# EAGLE design controller (EAGLE 9.5.1)
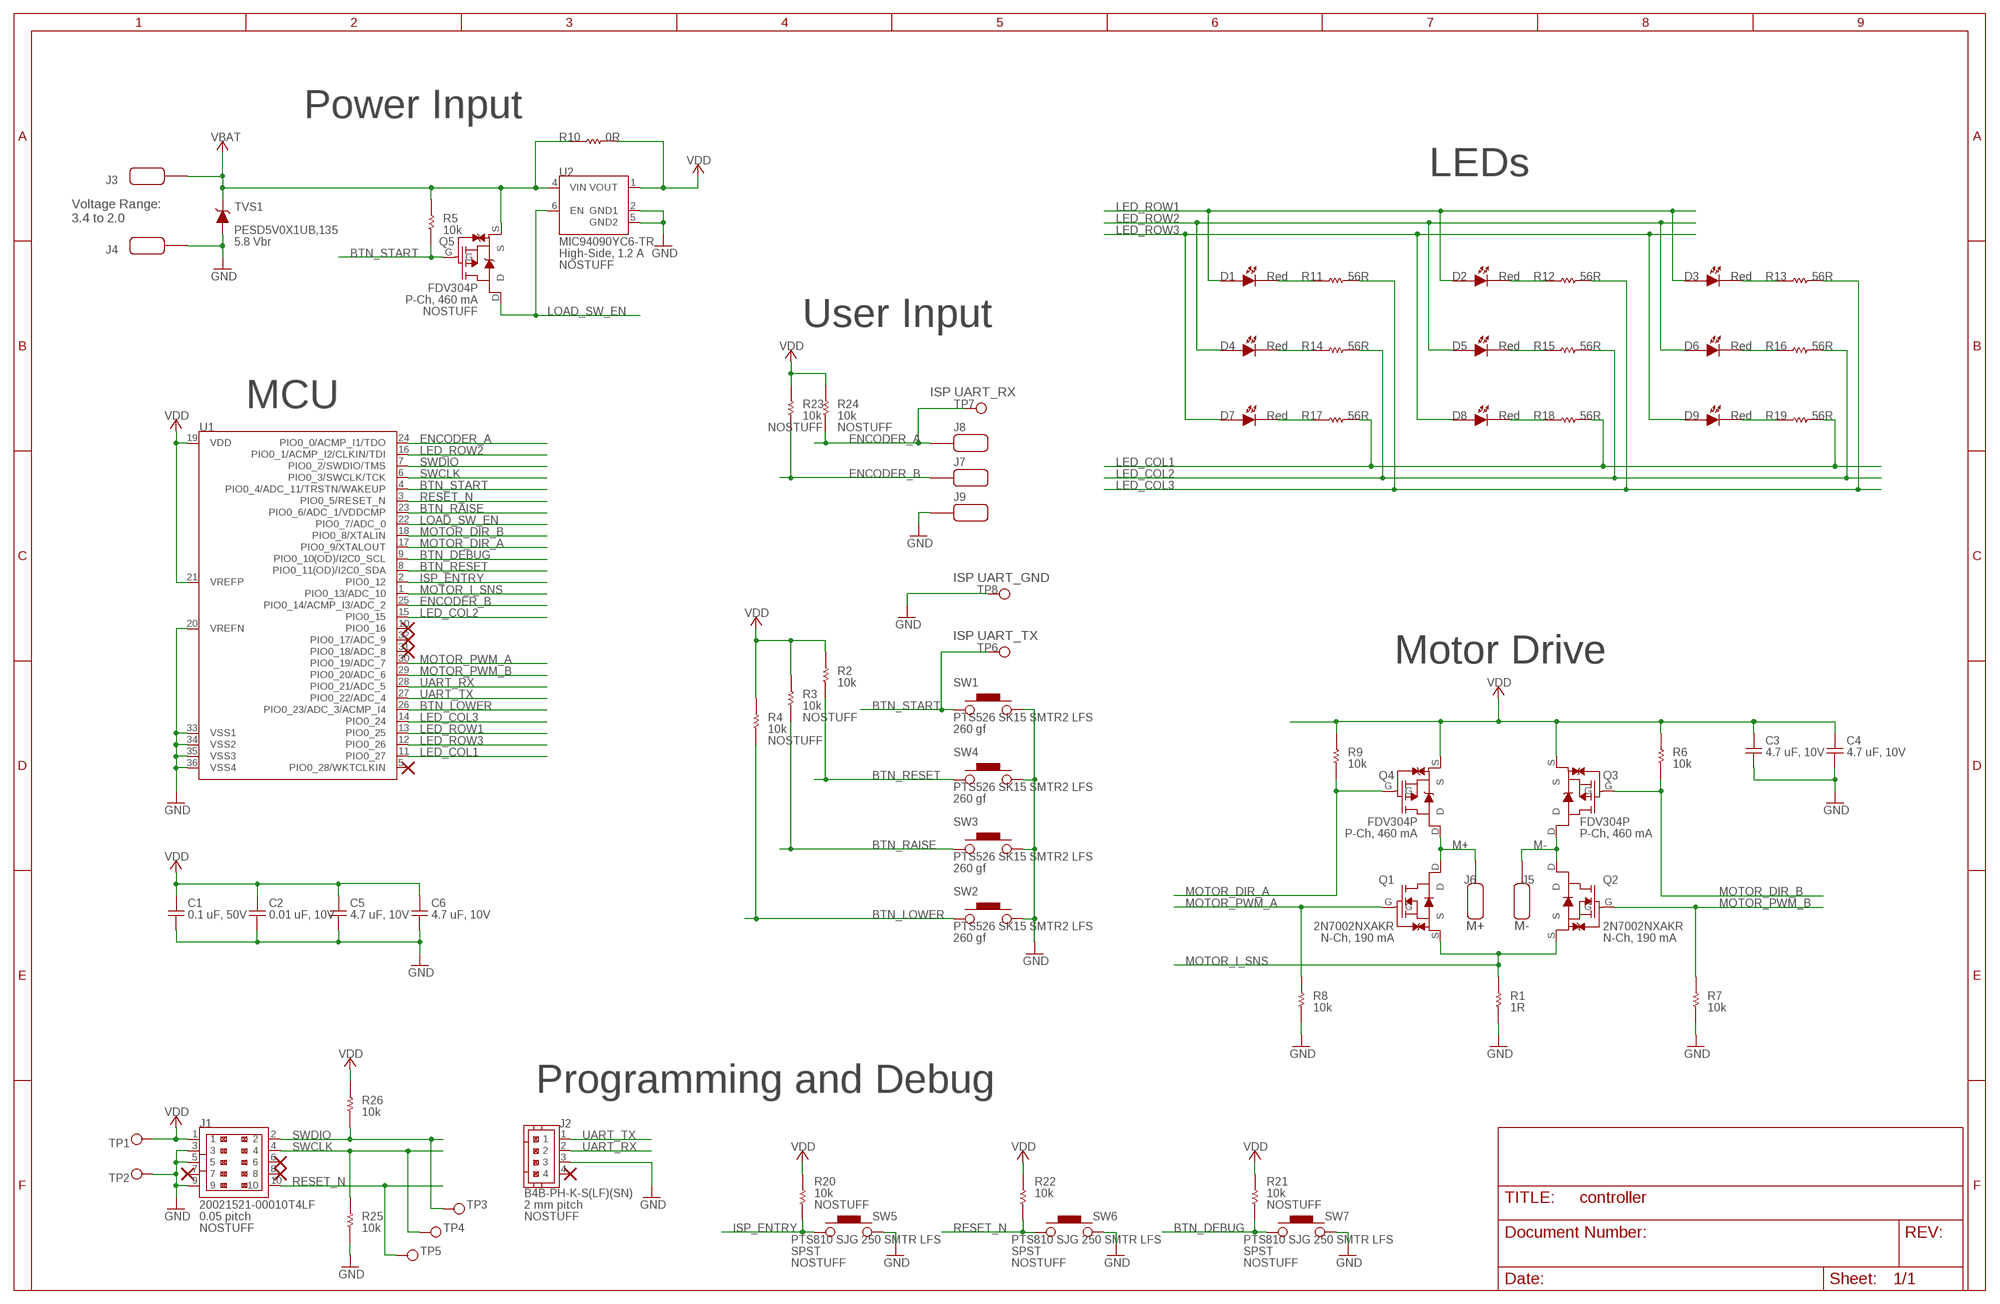
[diagram p0: schematic, sheet 1]

## Parts
C1  CAP_C1608X7R1H104K080AA  [CAP_0603]
C2  CAP_CL10B103KB8NNNC  [CAP_0603]
C3  CAP_CGB3B1X5R1A475M055AC  [CAP_0603]
C4  CAP_CGB3B1X5R1A475M055AC  [CAP_0603]
C5  CAP_CGB3B1X5R1A475M055AC  [CAP_0603]
C6  CAP_CGB3B1X5R1A475M055AC  [CAP_0603]
D1  LED_150060RS75000  [LED_0603]
D2  LED_150060RS75000  [LED_0603]
D3  LED_150060RS75000  [LED_0603]
D4  LED_150060RS75000  [LED_0603]
D5  LED_150060RS75000  [LED_0603]
D6  LED_150060RS75000  [LED_0603]
D7  LED_150060RS75000  [LED_0603]
D8  LED_150060RS75000  [LED_0603]
D9  LED_150060RS75000  [LED_0603]
J1  20021521-00010T4LF  [HEADER_2X5_50MIL_SHROUDED_KEYED]
J2  B4B-PH-K-S  [JST-PH_2MM_TH]
J3  PAD_1P4X3P25MM  [PAD_1P4MM_X_3P25MM]
J4  PAD_1P4X3P25MM  [PAD_1P4MM_X_3P25MM]
J5  PAD_1P4X3P25MM  [PAD_1P4MM_X_3P25MM]
J6  PAD_1P4X3P25MM  [PAD_1P4MM_X_3P25MM]
J7  PAD_1P4X3P25MM  [PAD_1P4MM_X_3P25MM]
J8  PAD_1P4X3P25MM  [PAD_1P4MM_X_3P25MM]
J9  PAD_1P4X3P25MM  [PAD_1P4MM_X_3P25MM]
Q1  2N7002NXAKR  [SOT-23_FET_GENERIC]
Q2  2N7002NXAKR  [SOT-23_FET_GENERIC]
Q3  FDV304P  [SOT-23_FET_GENERIC]
Q4  FDV304P  [SOT-23_FET_GENERIC]
Q5  FDV304P  [SOT-23_FET_GENERIC]
R1  RES_1R_RMCF0603FT1R00  [RES_0603]
R2  RES_10K_RC0603FR-0710KL  [RES_0603]
R3  RES_10K_RC0603FR-0710KL  [RES_0603]
R4  RES_10K_RC0603FR-0710KL  [RES_0603]
R5  RES_10K_RC0603FR-0710KL  [RES_0603]
R6  RES_10K_RC0603FR-0710KL  [RES_0603]
R7  RES_10K_RC0603FR-0710KL  [RES_0603]
R8  RES_10K_RC0603FR-0710KL  [RES_0603]
R9  RES_10K_RC0603FR-0710KL  [RES_0603]
R10  RES_0R_RC0603JR-070RL  [RES_0603]
R11  RES_56R_RC0603FR-0756RL  [RES_0603]
R12  RES_56R_RC0603FR-0756RL  [RES_0603]
R13  RES_56R_RC0603FR-0756RL  [RES_0603]
R14  RES_56R_RC0603FR-0756RL  [RES_0603]
R15  RES_56R_RC0603FR-0756RL  [RES_0603]
R16  RES_56R_RC0603FR-0756RL  [RES_0603]
R17  RES_56R_RC0603FR-0756RL  [RES_0603]
R18  RES_56R_RC0603FR-0756RL  [RES_0603]
R19  RES_56R_RC0603FR-0756RL  [RES_0603]
R20  RES_10K_RC0603FR-0710KL  [RES_0603]
R21  RES_10K_RC0603FR-0710KL  [RES_0603]
R22  RES_10K_RC0603FR-0710KL  [RES_0603]
R23  RES_10K_RC0603FR-0710KL  [RES_0603]
R24  RES_10K_RC0603FR-0710KL  [RES_0603]
R25  RES_10K_RC0603FR-0710KL  [RES_0603]
R26  RES_10K_RC0603FR-0710KL  [RES_0603]
SW1  PTS526_SK15_SMTR2_LFS  [PTS526-G_LEAD]
SW2  PTS526_SK15_SMTR2_LFS  [PTS526-G_LEAD]
SW3  PTS526_SK15_SMTR2_LFS  [PTS526-G_LEAD]
SW4  PTS526_SK15_SMTR2_LFS  [PTS526-G_LEAD]
SW5  PTS810_SJG_250_SMTR_LFS  [PTS810]
SW6  PTS810_SJG_250_SMTR_LFS  [PTS810]
SW7  PTS810_SJG_250_SMTR_LFS  [PTS810]
TP1  TP_1P6_MM_ROUND  [TP_1P6_MM_ROUND]
TP2  TP_1P6_MM_ROUND  [TP_1P6_MM_ROUND]
TP3  TP_1P6_MM_ROUND  [TP_1P6_MM_ROUND]
TP4  TP_1P6_MM_ROUND  [TP_1P6_MM_ROUND]
TP5  TP_1P6_MM_ROUND  [TP_1P6_MM_ROUND]
TP6  TP_1P6_MM_ROUND  [TP_1P6_MM_ROUND]
TP7  TP_1P6_MM_ROUND  [TP_1P6_MM_ROUND]
TP8  TP_1P6_MM_ROUND  [TP_1P6_MM_ROUND]
TVS1  PESD5V0X1UB,135  [SOD523]
U1  LPC822M101JHI33ELPC82X_VQFN33_HAND_SOLDER  [LPC82X_VQFN33_HAND_SOLDER]
U2  MIC94090YC6  [SC-70-6_GENERIC]

## Nets
BTN_DEBUG: R21.P$1 SW7.P1 U1.9(PIO0_10(OD)/I2C0_SCL)
BTN_LOWER: R4.P$1 SW2.1 U1.26(PIO0_23/ADC_3/ACMP_I4)
BTN_RAISE: R3.P$1 SW3.1 U1.23(PIO0_6/ADC_1/VDDCMP)
BTN_RESET: R2.P$1 SW4.1 U1.8(PIO0_11(OD)/I2C0_SDA)
BTN_START: Q5.G R5.P$1 SW1.1 TP6.P$1(P1) U1.4(PIO0_4/ADC_11/TRSTN/WAKEUP)
ENCODER_A: J8.1(PAD) R24.P$1 TP7.P$1(P1) U1.24(PIO0_0/ACMP_I1/TDO)
ENCODER_B: J7.1(PAD) R23.P$1 U1.25(PIO0_14/ACMP_I3/ADC_2)
GND: C1.P$2 C2.P$2 C3.P$2 C4.P$2 C5.P$2 C6.P$2 J1.3 J1.5 J1.9 J2.3 J4.1(PAD) J9.1(PAD) R1.P$1 R7.P$1 R8.P$1 R25.P$1 SW1.3(P2) SW2.3(P2) SW3.3(P2) SW4.3(P2) SW5.P3(P2) SW6.P3(P2) SW7.P3(P2) TP2.P$1(P1) TP8.P$1(P1) TVS1.A U1.20(VREFN) U1.33(VSS1) U1.34(VSS2) U1.35(VSS3) U1.36(VSS4) U2.2(GND1) U2.5(GND2)
ISP_ENTRY: R20.P$1 SW5.P1 U1.2(PIO0_12)
LED_COL1: R17.P$2 R18.P$2 R19.P$2 U1.11(PIO0_27)
LED_COL2: R14.P$2 R15.P$2 R16.P$2 U1.15(PIO0_15)
LED_COL3: R11.P$2 R12.P$2 R13.P$2 U1.14(PIO0_24)
LED_ROW1: D1.A D2.A D3.A U1.13(PIO0_25)
LED_ROW2: D4.A D5.A D6.A U1.16(PIO0_1/ACMP_I2/CLKIN/TDI)
LED_ROW3: D7.A D8.A D9.A U1.12(PIO0_26)
LOAD_SW_EN: Q5.D U1.22(PIO0_7/ADC_0) U2.6(EN)
M+: J6.1(PAD) Q1.D Q4.D
M-: J5.1(PAD) Q2.D Q3.D
MOTOR_DIR_A: Q4.G R9.P$1 U1.17(PIO0_9/XTALOUT)
MOTOR_DIR_B: Q3.G R6.P$1 U1.18(PIO0_8/XTALIN)
MOTOR_I_SNS: Q1.S Q2.S R1.P$2 U1.1(PIO0_13/ADC_10)
MOTOR_PWM_A: Q1.G R8.P$2 U1.30(PIO0_19/ADC_7)
MOTOR_PWM_B: Q2.G R7.P$2 U1.29(PIO0_20/ADC_6)
N$2: D1.K R11.P$1
N$4: D4.K R14.P$1
N$8: D7.K R17.P$1
N$9: D2.K R12.P$1
N$10: D5.K R15.P$1
N$11: D8.K R18.P$1
N$12: D3.K R13.P$1
N$13: D6.K R16.P$1
N$14: D9.K R19.P$1
RESET_N: J1.10 R22.P$1 SW6.P1 TP5.P$1(P1) U1.3(PIO0_5/RESET_N)
SWCLK: J1.4 R25.P$2 TP4.P$1(P1) U1.6(PIO0_3/SWCLK/TCK)
SWDIO: J1.2 R26.P$1 TP3.P$1(P1) U1.7(PIO0_2/SWDIO/TMS)
UART_RX: J2.2 U1.28(PIO0_21/ADC_5)
UART_TX: J2.1 U1.27(PIO0_22/ADC_4)
VBAT: J3.1(PAD) Q5.S R5.P$2 R10.P$1 TVS1.K U2.4(VIN)
VDD: C1.P$1 C2.P$1 C3.P$1 C4.P$1 C5.P$1 C6.P$1 J1.1 Q3.S Q4.S R2.P$2 R3.P$2 R4.P$2 R6.P$2 R9.P$2 R10.P$2 R20.P$2 R21.P$2 R22.P$2 R23.P$2 R24.P$2 R26.P$2 TP1.P$1(P1) U1.19(VDD) U1.21(VREFP) U2.1(VOUT)
Unconnected: J1.6 J1.7 J1.8 J2.4 U1.5(PIO0_28/WKTCLKIN) U1.10(PIO0_16) U1.31(PIO0_18/ADC_8) U1.32(PIO0_17/ADC_9)

## Notes on the sheet
- Power Input
- LEDs
- Voltage Range:
  3.4 to 2.0
- User Input
- ISP UART_RX
- MCU
- ISP UART_GND
- ISP UART_TX
- Motor Drive
- M+ | M-
- Programming and Debug

## Library data of the parts
C1 = teatotler:CAP_C1608X7R1H104K080AA; COST_X1: 0.1; COST_X100: 0.022; COST_X500: 0.0154; DESCRIPTION: Capacitor, 0.1 uF, 50V, 0603, X7R; DISPLAY: 0.1 uF, 50V; DISTRIBUTOR: Digikey; DIST_PART_NO: 445-1314-1-ND; MFG: TDK; MFG_PART_NO: C1608X7R1H104K080AA; PACKAGE: 0603
C2 = teatotler:CAP_CL10B103KB8NNNC; COST_X1: 0.1; COST_X100: 0.0078; COST_X500: 0.00542; DESCRIPTION: Capacitor, 10 nF, 50V, 0603, X7R; DISPLAY: 0.01 uF, 10V; DISTRIBUTOR: Digikey; DIST_PART_NO: 1276-1009-1-ND; MFG: Samsung; MFG_PART_NO: CL10B103KB8NNNC; PACKAGE: 0603
C3-C6 = teatotler:CAP_CGB3B1X5R1A475M055AC; COST_X1: 0.24; COST_X10: 0.1; COST_X100: 0.1; COST_X500: 0.06626; DESCRIPTION: Capacitor, 4.7 uF, 10V, 0603, X5R; DISPLAY: 4.7 uF, 10V; DISTRIBUTOR: Digikey; DIST_PART_NO: 445-7483-1-ND; MFG: TDK; MFG_PART_NO: CGB3B1X5R1A475M055AC; PACKAGE: 0603
D1-D9 = teatotler:LED_150060RS75000; COST_X1: 0.14; COST_X10: 0.14; COST_X100: 0.114; COST_X500: 0.099; DESCRIPTION: LED, Red, Clear, V_f=2V, 250 mcd @ 20 mA, 0603; DISPLAY: Red; DISTRIBUTOR: Digikey; DIST_PART_NO: 732-4978-1-ND; MFG: Wurth Elektronik; MFG_PART_NO: 150060RS75000; PACKAGE: 0603
J1 = teatotler:20021521-00010T4LF; COST_X1: 1.43; COST_X10: 1.253; COST_X100: 1.0813; COST_X500: 0.8847; DESCRIPTION: Header, 2x10, 0.050 mil pitch, SMT, shrouded, keyed; DISPLAY: 0.05 pitch; DISTRIBUTOR: Digikey; DIST_PART_NO: 609-6534-ND; MFG: Amphenol; MFG_PART_NO: 20021521-00010T4LF; NOSTUFF: NOSTUFF; PACKAGE: SMT
J2 = teatotler:B4B-PH-K-S; COST_X1: 0.24; COST_X10: 0.227; COST_X100: 0.1573; COST_X500: 0.13312; DESCRIPTION: Header, 1x4, 0.2 mm pitch, TH, shrouded, keyed; DISPLAY: 2 mm pitch; DISTRIBUTOR: Digikey; DIST_PART_NO: 455-1706-ND; MFG: JST; MFG_PART_NO: B4B-PH-K-S(LF)(SN); NOSTUFF: NOSTUFF; PACKAGE: TH
J3-J9 = teatotler:PAD_1P4X3P25MM; DESCRIPTION: SMT solder pad; DISPLAY: SMT Pad
Q1 Q2 = teatotler:2N7002NXAKR: MOSFET N-Channel 60V, V_gs=20V 190mA (Ta) @ V_gs=10V 4.5Ohm @ 100mA, 10V; COST_X1: 0.1; COST_X10: 0.078; COST_X100: 0.0427; COST_X500: 0.02626; DESCRIPTION: N-channel MOSFET, 60 V, 190 mA @ V_gs=10 V, SOT-23; DISPLAY: N-Ch, 190 mA; DISTRIBUTOR: Digikey; DIST_PART_NO: 1727-8643-1-ND; MFG: Nexperia; MFG_PART_NO: 2N7002NXAKR; PACKAGE: SOT-23
Q3 Q4 = teatotler:FDV304P: MOSFET P-Channel MOSFET P-CH 25V 460MA SOT-23; COST_X1: 0.30; COST_X10: 0.247; COST_X100: 0.1309; COST_X500: 0.08614; DESCRIPTION: P-channel MOSFET, 25 V, 460 mA @ V_gs=8 V, SOT-23; DISPLAY: P-Ch, 460 mA; DISTRIBUTOR: Digikey; DIST_PART_NO: FDV304PCT-ND; MFG: On Semi; MFG_PART_NO: FDV304P; PACKAGE: SOT-23
Q5 = teatotler:FDV304P: MOSFET P-Channel MOSFET P-CH 25V 460MA SOT-23; COST_X1: 0.30; COST_X10: 0.247; COST_X100: 0.1309; COST_X500: 0.08614; DESCRIPTION: P-channel MOSFET, 25 V, 460 mA @ V_gs=8 V, SOT-23; DISPLAY: P-Ch, 460 mA; DISTRIBUTOR: Digikey; DIST_PART_NO: FDV304PCT-ND; MFG: On Semi; MFG_PART_NO: FDV304P; NOSTUFF: NOSTUFF; PACKAGE: SOT-23
R1 = teatotler:RES_1R_RMCF0603FT1R00; COST_X1: 0.1; COST_X10: 0.025; COST_X100: 0.01020; COST_X500: 0.01020; DESCRIPTION: Resistor, 1R, 0603; DISPLAY: 1R; DISTRIBUTOR: Digikey; DIST_PART_NO: RMCF0603FT1R00CT-ND; MFG: Stackpole; MFG_PART_NO: RMCF0603FT1R00; PACKAGE: 0603
R2 R5-R9 R22 R25 R26 = teatotler:RES_10K_RC0603FR-0710KL; COST_X1: .01; COST_X100: .0063; COST_X500: .00382; DESCRIPTION: Resistor, 10k, 1%, 0603, 100 ppm/C; DISPLAY: 10k; DISTRIBUTOR: Digikey; DIST_PART_NO: 311-10.0KHRCT-ND; MFG: Yageo; MFG_PART_NO: RC0603FR-0710KL; PACKAGE: 0603
R3 R4 R20 R21 R23 R24 = teatotler:RES_10K_RC0603FR-0710KL; COST_X1: .01; COST_X100: .0063; COST_X500: .00382; DESCRIPTION: Resistor, 10k, 1%, 0603, 100 ppm/C; DISPLAY: 10k; DISTRIBUTOR: Digikey; DIST_PART_NO: 311-10.0KHRCT-ND; MFG: Yageo; MFG_PART_NO: RC0603FR-0710KL; NOSTUFF: NOSTUFF; PACKAGE: 0603
R10 = teatotler:RES_0R_RC0603JR-070RL; COST_X1: 0.1; COST_X100: 0.0045; COST_X500: 0.00278; DESCRIPTION: Resistor, 0R, 0603; DISPLAY: 0R; DISTRIBUTOR: Digikey; DIST_PART_NO: 311-0.0GRCT-ND; MFG: Yageo; MFG_PART_NO: RC0603JR-070RL; PACKAGE: 0603
R11-R19 = teatotler:RES_56R_RC0603FR-0756RL; COST_X1: 0.1; COST_X10: 0.023; COST_X100: 0.0094; COST_X500: 0.0094; DESCRIPTION: Resistor, 56R, 1%, 0603, 100 ppm/C; DISPLAY: 56R; DISTRIBUTOR: Digikey; DIST_PART_NO: 311-56.0HRCT-ND; MFG: Yageo; MFG_PART_NO: RC0603FR-0756RL; PACKAGE: 0603
SW1-SW4 = teatotler:PTS526_SK15_SMTR2_LFS; COST_X1: 0.1; COST_X10: 0.085; COST_X100: 0.075; COST_X500: 0.06768; DESCRIPTION: Tactile switch, 260 gf, 5.2 mm x 5.2 mm, 1.5 mm height; DISPLAY: 260 gf; DISTRIBUTOR: Digikey; DIST_PART_NO: CKN12221-1-ND; MFG: C and K; MFG_PART_NO: PTS526 SK15 SMTR2 LFS; PACKAGE: SMT
SW5-SW7 = teatotler:PTS810_SJG_250_SMTR_LFS; COST_X1: 0.3; COST_X100: 0.2585; COST_X500: 0.2068; DESCRIPTION: Tact switch, SMT, 4.2mm x 3.2mm, 400 gf; DISPLAY: SPST; DISTRIBUTOR: Digikey; DIST_PART_NO: CKN10504CT-ND; MFG: C and K; MFG_PART_NO: PTS810 SJG 250 SMTR LFS; NOSTUFF: NOSTUFF; PACKAGE: SMT
TP1-TP8 = teatotler:TP_1P6_MM_ROUND: Test Point 1.6 mm Round; DESCRIPTION: Test point, SMT, circular, 1.6 mm diameter; DISPLAY: Test Point
TVS1 = teatotler:PESD5V0X1UB,135; COST_X1: 0.45; COST_X100: 0.288; COST_X500: 0.22626; DESCRIPTION: TVS diode, 5 Vs, 5.8 Vbr, 8 Vcl, 0.95 pF, 8 kV, 200 mW; DISPLAY: 5.8 Vbr; DISTRIBUTOR: Digikey; DIST_PART_NO: 1727-5906-1-ND; MFG: NXP; MFG_PART_NO: PESD5V0X1UB,135; PACKAGE: SOD523
U1 = teatotler:LPC822M101JHI33E; COST_X1: 1.54; COST_X10: 1.383; COST_X100: 1.1119; COST_X500: 0.9135; DESCRIPTION: Microcontroller, Cortex M0+, 4 kB SRAM, 16 kB Flash, 30 MHz; DISPLAY: Cortex M0+; DISTRIBUTOR: Digikey; DIST_PART_NO: 568-11571-ND; MFG: NXP; MFG_PART_NO: LPC822M101JHI33E; PACKAGE: HVQFN33 5x5
U2 = teatotler:MIC94090YC6; COST_X1: 0.31; COST_X10: 0.31; COST_X100: 0.26; COST_X500: 0.24; DESCRIPTION: Load switch, high-side, 1.2 A, SC-70-6; DISPLAY: High-Side, 1.2 A; DISTRIBUTOR: Digikey; DIST_PART_NO: 576-3484-1-ND; MFG: Micrel; MFG_PART_NO: MIC94090YC6-TR; NOSTUFF: NOSTUFF; PACKAGE: SC-70-6

## Board
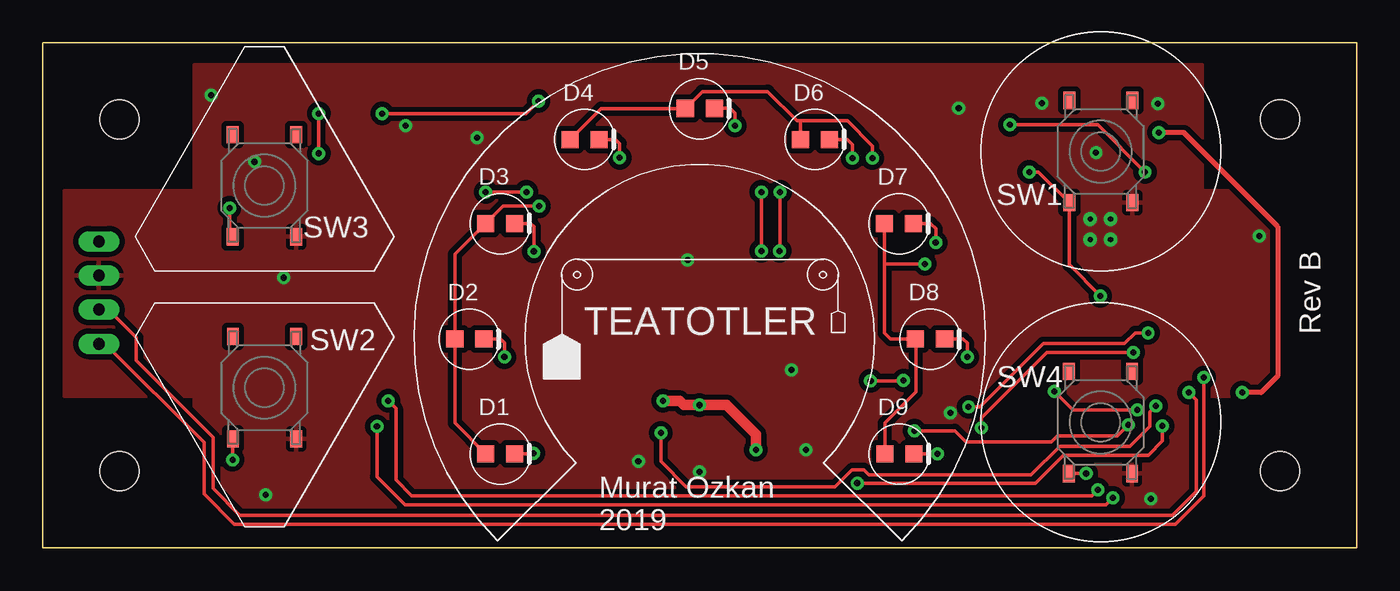
[diagram p1: board, top side]
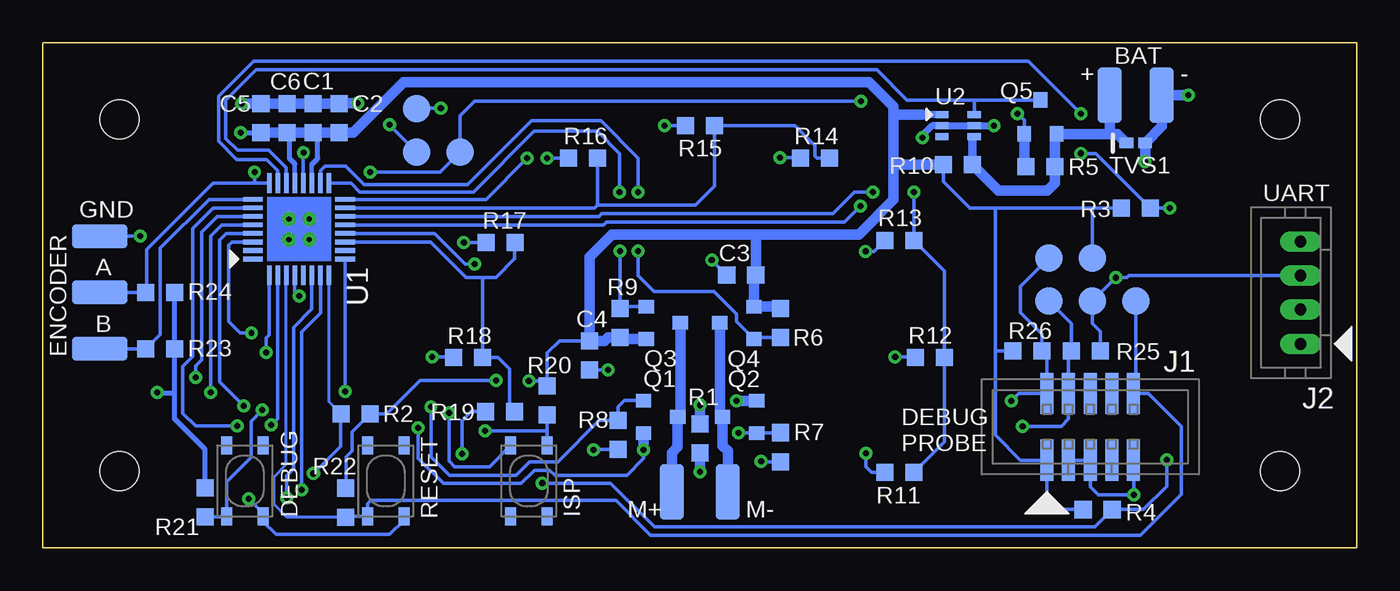
[diagram p2: board, bottom side, seen from below]

Size 77 x 29.62 mm. Coordinates in mm from the lower left corner, seen from the top.
Outline: 0,29.62 77,29.62 77,0 0,0 0,29.62
Copper layers (1*16): Top 0.035mm / dielectric 0.17mm / Bottom 0.035mm
Design rules "default *": minimum track width 7mil, minimum drill 13mil, track to track 6mil, track to pad 6mil, pad to pad 6mil, via to via 6mil, smd to smd 0mil, copper to edge 20mil, drill to drill 7mil, minimum pad ring 10mil, minimum via ring 8mil, stop-mask expansion 4mil, vias tented up to drill 15mil, thermal gap 10mil
Holes 2.29 mm at 4.5,25.12 4.5,4.5 72.5,25.12 72.5,4.5
tKeepout: area 1,1 to 8,8; area 1,21.6 to 8,28.6; area 69,21.6 to 76,28.6; area 69,1 to 76,8; 4 lines
bKeepout: area 69,21.6 to 76,28.7; area 69,1 to 76,8; area 1,21.6 to 8,28.6; area 1,1 to 8,8; 4 lines

### Footprints (pad centres in the part's own frame; a part is rotated, then mirrored left to right if it is on the bottom)
CAP_0603 = smd 1 x 1: P$1 -0.85,0; P$2 0.85,0
LED_0603 = smd 1 x 1: A -0.85,0; K 0.85,0
HEADER_2X5_50MIL_SHROUDED_KEYED = smd 2.413 x 0.762: 1 -1.956,2.54; 2 1.956,2.54; 3 -1.956,1.27; 4 1.956,1.27; 5 -1.956,0; 6 1.956,0; 7 -1.956,-1.27; 8 1.956,-1.27; 9 -1.956,-2.54; 10 1.956,-2.54
JST-PH_2MM_TH = drill 0.7 long: 1 0,0; 2 0,-2; 3 0,-4; 4 0,-6
PAD_1P4MM_X_3P25MM = smd 1.4 x 3.25: 1 0,0
SOT-23_FET_GENERIC = smd 0.8 x 0.9: D 0,1; G -0.95,-1; S 0.95,-1
RES_0603 = smd 1 x 1: P$1 -0.85,0; P$2 0.85,0
PTS526-G_LEAD = smd 1 x 0.7: 1 -3,1.85; 2 3,1.85; 3 -3,-1.85; 4 3,-1.85
PTS810 = smd 1.05 x 0.65: P1 -2.075,1.075; P2 2.075,1.075; P3 -2.075,-1.075; P4 2.075,-1.075
TP_1P6_MM_ROUND = smd 1.6 x 1.6: P$1 0,0
SOD523 = smd 0.8 x 0.6: A -0.55,0; K 0.55,0
LPC82X_VQFN33_HAND_SOLDER = smd 1.15 x 0.27: 1 -2.7,1.75; 2 -2.7,1.25; 3 -2.7,0.75; 4 -2.7,0.25; 5 -2.7,-0.25; 6 -2.7,-0.75; 7 -2.7,-1.25; 8 -2.7,-1.75; 17 2.7,-1.75; 18 2.7,-1.25; 19 2.7,-0.75; 20 2.7,-0.25; 21 2.7,0.25; 22 2.7,0.75; 23 2.7,1.25; 24 2.7,1.75 | smd 0.27 x 1.15: 9 -1.75,-2.7; 10 -1.25,-2.7; 11 -0.75,-2.7; 12 -0.25,-2.7; 13 0.25,-2.7; 14 0.75,-2.7; 15 1.25,-2.7; 16 1.75,-2.7; 25 1.75,2.7; 26 1.25,2.7; 27 0.75,2.7; 28 0.25,2.7; 29 -0.25,2.7; 30 -0.75,2.7; 31 -1.25,2.7; 32 -1.75,2.7 | drill 0.3 pad 0.6: 33 -0.6,0.6; 34 0.6,0.6; 35 -0.6,-0.6; 36 0.6,-0.6
SC-70-6_GENERIC = smd 0.42 x 0.77: 1 0.65,0.95; 2 0,0.95; 3 -0.65,0.95; 4 -0.65,-0.95; 5 0,-0.95; 6 0.65,-0.95

### Placement (x,y rotation side)
C1  61.16,25.19 90 bottom
C2  59.64,25.19 90 bottom
C3  36.07,15.99 180 bottom
C4  44.96,11.29 270 bottom
C5  64.21,25.19 90 bottom
C6  62.69,25.19 90 bottom
D1  26.8,5.52 0 top
D2  25,12.24 0 top
D3  26.8,19.02 0 top
D4  31.75,23.94 0 top
D5  38.5,25.77 0 top
D6  45.25,23.94 0 top
D7  50.18,19.02 0 top
D8  52,12.24 0 top
D9  50.2,5.52 0 top
J1  15.62,7.1 90 bottom
J2  3.3,11.97 180 bottom
J3  14.48,26.53 0 bottom
J4  11.43,26.53 0 bottom
J5  36.86,3.29 0 bottom
J6  40.13,3.29 0 bottom
J7  73.66,11.68 270 bottom
J8  73.66,14.98 270 bottom
J9  73.66,18.28 270 bottom
Q1  40.79,7.69 270 bottom
Q2  36.17,7.69 90 bottom
Q3  36.32,13.2 90 bottom
Q4  40.64,13.2 270 bottom
Q5  18.54,25.26 0 bottom
R1  38.48,6.42 90 bottom
R2  58.67,7.87 0 bottom
R3  12.95,19.93 180 bottom
R4  15.19,2.25 180 bottom
R5  18.54,22.34 0 bottom
R6  33.78,13.2 90 bottom
R7  33.78,5.91 90 bottom
R8  43.28,6.62 90 bottom
R9  43.18,13.2 270 bottom
R10  23.37,22.47 180 bottom
R11  26.8,4.44 0 bottom
R12  25.02,11.17 0 bottom
R13  26.8,18.03 0 bottom
R14  31.75,22.85 0 bottom
R15  38.48,24.76 0 bottom
R16  45.34,22.85 0 bottom
R17  50.16,17.9 0 bottom
R18  52.07,11.17 0 bottom
R19  50.19,7.99 0 bottom
R20  47.45,8.65 90 bottom
R21  67.49,2.68 90 bottom
R22  59.26,2.66 90 bottom
R23  70.1,11.68 0 bottom
R24  70.1,14.98 0 bottom
R25  15.88,11.55 180 bottom
R26  19.3,11.55 180 bottom
SW1  61.99,23.23 90 top
SW2  13,9.39 90 top
SW3  12.99,21.24 90 top
SW4  61.98,7.36 90 top
SW5  48.51,3.93 270 bottom
SW6  56.9,3.93 90 bottom
SW7  65.15,3.93 90 bottom
TP1  15.49,17.01 0 bottom
TP2  15.49,14.47 0 bottom
TP3  18.03,17.01 0 bottom
TP4  18.03,14.47 0 bottom
TP5  12.95,14.47 0 bottom
TP6  52.55,23.21 0 bottom
TP7  55.09,23.21 0 bottom
TP8  55.09,25.75 0 bottom
TVS1  12.95,23.74 180 bottom
U1  61.98,18.69 90 bottom
U2  23.37,24.76 90 bottom

### Tracks (layer width: path | path; a pad name or v marks a point on that pad's centre or on a via)
BTN_DEBUG  (via drill 0.35)
  Top 0.203: v64.14,8.09 60.38,8.09 v59.28,9.19
  Bottom 0.203: R21.P$1 66.25,1.83 SW7.P1 66.22,1.86 66.22,3.88 64.8,5.3 64.8,7.43 v64.14,8.09 | U1.9 59.28,9.19 v59.28,9.19
BTN_LOWER  (via drill 0.36)
  Top 0.203: SW2.1 11.12,6.37 v11.12,5.17 | v47.73,3.8 58.17,3.8 59.79,5.43 64.77,5.43 65.61,6.27 v65.61,7.15
  Bottom 0.203: v11.12,5.17 11.12,3.62 12.5,2.25 R4.P$1 15.36,1.24 41.15,1.24 43.71,3.8 v47.73,3.8 | v65.61,7.15 68.05,7.15 68.78,7.89 68.78,10.63 68.2,11.22 68.2,18.74 67,19.94 U1.26
BTN_RAISE  (via drill 0.36)
  Top 0.203: v10.95,19.93 10.95,18.44 SW3.1 | v16.18,23.13 v16.18,25.47
  Bottom 0.203: v10.95,19.93 R3.P$1 15.3,23.13 v16.18,23.13 | v16.18,25.47 19.25,28.54 64.64,28.54 66.7,26.48 66.7,23.84 65.63,22.78 63.88,22.78 63.23,22.12 U1.23
BTN_RESET  (via drill 0.36)
  Top 0.203: SW4.1 v61.14,4.36 | v61.14,4.36
  Bottom 0.178: R2.P$1 60.23,8.57 U1.8
  Bottom 0.203: R2.P$1 59.54,7.85 59.54,5.96 v61.14,4.36
BTN_START  (via drill 0.35, 0.36)
  Top 0.203: v19.89,25.47 28.32,25.47 v29.06,26.2 | v57.81,22.04 58.34,22.04 SW1.1 60.15,16.61 v61.98,14.77
  Bottom 0.203: Q5.G 19.49,25.07 v19.89,25.47 | v61.98,14.77 62.23,15.02 U1.4 | v57.81,22.04 53.72,22.04 TP6.P$1 52.55,25.34 51.69,26.2 v29.06,26.2
  Bottom 0.61: Q5.G 19.49,22.44 R5.P$1
ENCODER_A  (via drill 0.35)
  Top 0.203: v56.67,24.81 61.82,24.81 v64.59,22.04
  Bottom 0.203: J8.1 R24.P$1 70.89,15.04 70.89,17.49 67,21.39 64.59,21.39 | U1.24 64.59,21.39 | TP7.P$1 56.67,24.78 v56.67,24.81 | v64.59,22.04 64.59,21.39
ENCODER_B
  Bottom 0.203: J7.1 R23.P$1 70.1,12.53 70.1,17.57 67.24,20.44 U1.25
GND  (via drill 0.35, 0.36)
  Bottom 0.203: J1.3 J1.5 15.62,3.6 15.14,3.12 v13.06,3.12 13.06,5.12 J1.9 | J2.3 13.36,15.97 13.49,15.84 v14.12,15.84 TP2.P$1 15.49,13.17 15.03,12.71 R25.P$1 | J9.1 v71.3,18.28 | R8.P$1 44.72,5.77 v44.73,5.76 | C4.P$2 43.88,10.44 v43.87,10.43 | v64.92,2.89 64.08,2.04 SW7.P3 64.08,1.53 63.33,0.79 56.66,0.79 55.82,1.63 SW6.P3 | R7.P$1 34.89,5.06 v34.9,5.07 | TP8.P$1 55.07,25.77 v53.67,25.77 | C3.P$2 v37.8,16.88 | U1.20 v61.73,23.18 v61.72,23.18 | v65.33,26.05 65.31,26.04 | 59.6,26.08 C2.P$2 | SW5.P3 50.83,4.77 52.86,4.77 53.19,5.1 v53.19,7.92
  Bottom 0.406: v25.45,24.05 25.45,24.2 24.89,24.76 U2.2 U2.5 v21.26,24.76
  Bottom 0.61: v9.88,26.53 J4.1 11.43,24.71 TVS1.A v12.4,22.63 v12.41,22.64 | C2.P$2 C1.P$2 C6.P$2 C5.P$2 65.31,26.04 | R1.P$1 v38.48,4.46 | v58.55,26.08 59.6,26.08
  pour Top (isolate 0.305): 1.27,20.95 8.89,20.95 8.89,28.34 67.94,28.34 67.94,20.95 72.42,20.95 72.42,8.88 67.94,8.88 67.94,1.26 8.89,1.26 8.89,8.88 1.27,8.88
ISP_ENTRY  (via drill 0.35, 0.36)
  Top 0.203: v51.08,6.87 53.44,6.87 54.1,6.21 59.11,6.21 59.46,6.57 62.97,6.57 v63.6,7.21
  Bottom 0.203: R20.P$1 47.45,6.85 | 47.45,6.85 SW5.P1 | 47.45,6.85 47.47,6.87 v51.08,6.87 | v63.6,7.21 63.23,7.58 U1.2
LED_COL1
  Bottom 0.203: R17.P$2 49.34,17.87 49.34,16.96 50.43,15.87 51.22,15.87 | 51.22,15.87 R18.P$2 50.32,11.17 49.66,10.51 49.66,8.31 R19.P$2 | U1.11 54.27,17.94 52.2,15.87 51.22,15.87
LED_COL2
  Bottom 0.203: R15.P$2 37.64,24.74 | R14.P$2 31.62,22.85 31.75,22.98 31.75,23.59 32.91,24.74 37.64,24.74 | 37.64,24.74 37.64,21.23 38.76,20.11 44.5,20.11 | 44.5,20.11 44.67,19.94 U1.15 | R16.P$2 44.49,20.12 44.5,20.11
LED_COL3  (via drill 0.36)
  Top 0.203: v28.35,20.87 v25.96,20.87
  Bottom 0.203: R11.P$2 24.17,6.21 R12.P$2 24.17,16.25 R13.P$2 25.96,18.04 v25.96,20.87 | U1.14 44.41,19.44 44.25,19.6 30.71,19.6 29.44,20.87 v28.35,20.87
LED_ROW1  (via drill 0.36)
  Top 0.203: D1.A 24.15,7.32 D2.A 24.15,17.22 D3.A 26.96,20.03 v29.08,20.03
  Bottom 0.203: v29.08,20.03 30.02,19.09 43.97,19.09 44.12,18.94 U1.13
LED_ROW2  (via drill 0.36)
  Top 0.203: D4.A 32.73,25.77 D5.A 38.65,26.76 42.47,26.76 44.2,25.04 44.4,25.04 | v48.62,22.85 48.62,23.56 47.14,25.04 44.4,25.04 | D6.A 44.4,25.03 44.4,25.04
  Bottom 0.203: v48.62,22.85 51.03,20.44 U1.16
LED_ROW3  (via drill 0.36)
  Top 0.203: D9.A 49.35,7.33 51.16,9.14 D8.A 49.67,12.24 49.33,12.59 49.33,16.65 | D7.A 49.33,16.65 | v51.69,16.65 49.33,16.65
  Bottom 0.203: v51.69,16.65 52.25,16.65 54.03,18.44 U1.12
LOAD_SW_EN
  Bottom 0.203: Q5.D 22.43,26.26 | 22.43,26.26 26.35,26.26 28.12,28.03 64.49,28.03 66.27,26.26 66.27,23.99 65.58,23.31 63.74,23.31 62.73,22.29 U1.22 | 22.43,26.26 22.42,26.25 U2.6
M+
  Bottom 0.61: J6.1 40.13,5.58 39.79,5.92 Q1.D 39.64,7.84 Q4.D
M-
  Bottom 0.61: J5.1 36.85,5.68 37.17,6 Q2.D 37.32,7.84 Q3.D
MOTOR_DIR_A  (via drill 0.36)
  Top 0.203: v43.2,20.87 43.2,17.44 v43.18,17.42
  Bottom 0.203: Q4.G 43.08,14.15 R9.P$1 v43.18,17.42 | v43.2,20.87 43.2,23.13 44.5,24.43 48.21,24.43 51.77,20.87 58.42,20.87 58.94,21.39 U1.17
MOTOR_DIR_B  (via drill 0.36)
  Top 0.203: v42.11,20.87 v42.11,17.42
  Bottom 0.203: R6.P$1 35.22,12.35 Q3.G 36.35,13.27 36.35,13.71 37.67,15.03 41.17,15.03 42.11,15.97 v42.11,17.42 | v42.11,20.87 42.11,22.85 44.3,25.04 48.36,25.04 52.09,21.3 58.17,21.3 59.26,22.39 60.45,22.39 60.73,22.12 U1.18
MOTOR_I_SNS  (via drill 0.35, 0.36)
  Top 0.203: v54.99,7.03 54.99,7.61 58.85,11.47 v63.91,11.47
  Top 0.61: v41.78,5.76 41.78,6.67 40.08,8.37 v38.48,8.37 37.57,8.37 37.31,8.63 v36.35,8.63
  Bottom 0.203: v54.99,7.03 54.99,5.25 53.52,3.78 48.97,3.78 48.18,4.56 47.3,4.56 46.99,4.26 42.77,4.26 41.78,5.25 v41.78,5.76 | v63.91,11.47 63.91,12.31 63.73,12.49 U1.1
  Bottom 0.61: R1.P$2 v38.48,8.37 | v41.78,5.76 41.78,6.73 Q1.S | v36.35,8.63 35.18,8.63 Q2.S
MOTOR_PWM_A  (via drill 0.35)
  Top 0.203: v54.25,8.27 54.91,8.27 58.62,11.98 63.37,11.98 64.01,12.62 v64.77,12.62
  Bottom 0.203: Q1.G 42.92,8.64 43.28,8.27 R8.P$2 44.39,7.47 46.81,5.05 48.46,5.05 49.25,4.26 53.16,4.26 54.25,5.35 v54.25,8.27 | v64.77,12.62 65.43,12.62 66.09,13.28 66.09,17.75 65.9,17.94 U1.30
MOTOR_PWM_B  (via drill 0.36)
  Top 0.203: v65.23,8.32 64.87,7.97 64.87,7.13 63.7,5.96 59.59,5.96 57.91,4.28 48.41,4.28 48.11,4.59 47.42,4.59 46.43,3.6 37.69,3.6 36.22,5.07 v36.22,6.75
  Bottom 0.203: R7.P$2 35.15,6.76 Q2.G 36.21,6.74 v36.22,6.75 | U1.29 66.24,18.44 66.62,18.05 66.62,9.72 v65.23,8.32
N$2  (via drill 0.36)
  Top 0.203: v28.75,5.55 28.72,5.52 D1.K
  Bottom 0.203: R11.P$1 28.45,4.44 28.75,4.74 v28.75,5.55
N$4  (via drill 0.36)
  Top 0.203: v33.81,22.88 33.81,23.72 33.58,23.94 D4.K
  Bottom 0.203: R14.P$1 32.62,22.88 v33.81,22.88
N$8  (via drill 0.36)
  Top 0.203: v52.32,17.9 52.32,18.71 52.02,19.02 D7.K
  Bottom 0.203: R17.P$1 v52.32,17.9
N$9  (via drill 0.36)
  Top 0.203: v27.05,11.19 27.05,12.03 26.84,12.24 D2.K
  Bottom 0.203: R12.P$1 25.89,11.19 v27.05,11.19
N$10  (via drill 0.36)
  Top 0.203: v40.56,24.76 40.56,25.49 40.28,25.77 D5.K
  Bottom 0.203: R15.P$1 v40.56,24.76
N$11  (via drill 0.36)
  Top 0.203: v54.18,11.19 54.18,12.01 53.92,12.26 52.87,12.26 D8.K
  Bottom 0.203: R18.P$1 52.95,11.19 v54.18,11.19
N$12  (via drill 0.36)
  Top 0.203: v28.78,17.39 28.78,18.84 28.59,19.02 D3.K
  Bottom 0.203: v28.78,17.39 28.28,17.39 R13.P$1
N$13  (via drill 0.36)
  Top 0.203: v47.45,22.85 47.45,23.64 47.14,23.94 D6.K
  Bottom 0.203: R16.P$1 v47.45,22.85
N$14  (via drill 0.36)
  Top 0.203: D9.K 51.06,5.53 v52.43,5.53
  Bottom 0.203: v52.43,5.53 52.43,7.46 51.89,7.99 R19.P$1
RESET_N
  Bottom 0.178: R22.P$1 62.7,1.81 63.45,2.56 63.45,4.18 62.73,4.91 U1.3
  Bottom 0.203: TP5.P$1 12.95,9.19 J1.10 12.22,9.06 10.29,7.13 10.29,3.14 12.68,0.75 41.38,0.75 43.41,2.79 57.78,2.79 57.97,2.6 SW6.P1 59.21,1.85 R22.P$1
SWCLK  (via drill 0.36)
  Top 0.203: v19.58,7.13 19.58,4.18 21.23,2.53 62.31,2.53 v62.71,2.94
  Bottom 0.203: TP4.P$1 16.73,13.16 R25.P$2 16.89,11.38 J1.4 16.89,7.56 17.32,7.13 v19.58,7.13 | U1.6 61.23,14 62.31,12.92 62.31,4.64 62.71,4.23 v62.71,2.94
SWDIO  (via drill 0.36)
  Top 0.203: v20.24,8.63 20.7,8.17 20.7,3.98 21.61,3.06 61.47,3.06 v61.82,3.42
  Bottom 0.203: TP3.P$1 19.71,15.33 19.71,13.81 18.45,12.55 R26.P$1 18.16,11.26 J1.2 19.81,9.06 v20.24,8.63 | v61.82,3.42 61.82,12.67 60.73,13.76 U1.7
UART_RX  (via drill 0.36)
  Top 0.203: J2.2 3.85,13.97 5.49,12.34 5.49,10.99 9.98,6.49 9.98,3.5 11.56,1.92 66.19,1.92 67.59,3.32 67.59,8.68 v67.16,9.11
  Bottom 0.203: v67.16,9.11 67.16,18.28 66.5,18.94 U1.28
UART_TX  (via drill 0.36)
  Top 0.203: J2.1 3.67,11.97 9.45,6.19 9.45,3.17 11.23,1.39 66.37,1.39 68.05,3.06 v68.05,10
  Bottom 0.203: v68.05,10 68.05,10.66 67.69,11.02 67.69,18.51 66.76,19.44 U1.27
VBAT
  Bottom 0.406: 22.52,24.01 U2.4
  Bottom 0.508: R10.P$1 22.52,24.01
  Bottom 0.61: TVS1.K 14.03,24.26 14.5,24.26 | 14.5,24.26 Q5.S 17.69,24.16 R5.P$2 17.69,21.39 18.14,20.95 20.99,20.95 R10.P$1 | J3.1 14.48,24.29 14.5,24.26
VDD  (via drill 0.35, 0.36)
  Top 0.203: v50.44,9.82 50.42,9.8 v48.51,9.8
  Top 0.305: v65.41,24.35 66.85,24.35 72.36,18.84 72.36,10.08 71.4,9.11 v70.28,9.11
  Bottom 0.203: R3.P$2 15.52,19.93 | 15.52,19.93 21.18,19.93 | 21.18,19.93 22.68,19.93 24.23,21.48 24.23,22.46 R10.P$2 | TP1.P$1 15.49,19.91 15.52,19.93 | 21.18,19.93 21.18,11.55 | 21.18,11.55 21.18,6.62 19.71,5.15 J1.1 18.16,2.73 17.68,2.25 R4.P$2 | R26.P$2 21.18,11.55 | 69.27,11.66 R23.P$2 | C4.P$1 46.72,12.14 47.45,11.42 R20.P$2 47.74,9.8 v48.51,9.8 | v50.44,9.82 54.89,9.82 56.84,7.87 R2.P$2 58.88,6.81 58.88,5.71 59.23,5.35 59.23,3.53 R22.P$2 | 60.88,24.31 60.91,24.34 | 62.53,24.26 62.46,24.34
  Bottom 0.267: U1.19 61.23,22.48 | U1.21 62.23,22.52
  Bottom 0.305: R21.P$2 67.49,5.78 69.27,7.56 69.27,9.08 | 69.27,9.08 69.27,11.66 | R23.P$2 R24.P$2 | v65.41,24.35 64.22,24.35 C5.P$1 | 61.23,22.48 60.88,22.83 60.88,24.31 | 62.23,22.52 62.53,22.83 62.53,24.26 | v70.28,9.11 70.26,9.08 69.27,9.08
  Bottom 0.406: U2.1 25.48,25.41
  Bottom 0.61: C5.P$1 C6.P$1 62.46,24.34 C1.P$1 60.91,24.34 C2.P$1 58.81,24.34 55.85,27.3 28.57,27.3 27.15,25.87 27.15,25.39 | 27.15,25.39 27.15,22.47 | R10.P$2 27.15,22.47 | 25.48,25.41 27.14,25.41 27.15,25.39 | Q4.S 43.08,12.25 R9.P$2 43.88,12.35 44.08,12.14 C4.P$1 44.96,17.06 43.64,18.38 35.22,18.38 | R6.P$2 33.88,14.15 Q3.S 35.32,15.89 C3.P$1 35.22,18.38 | 35.22,18.38 29.18,18.38 27.15,20.41 27.15,22.47

### Text on the board
tPlace: Rev B | TEATOTLER | Murat Ozkan / 2019
bPlace: BAT | - | + | UART | GND | ENCODER | A | B | DEBUG / PROBE | M- | M+ | ISP | RESET | DEBUG